# Altium schematic sheet HBridge_Top_Level.SchDoc
size A; SheetNumber: 2; SheetTotal: 2
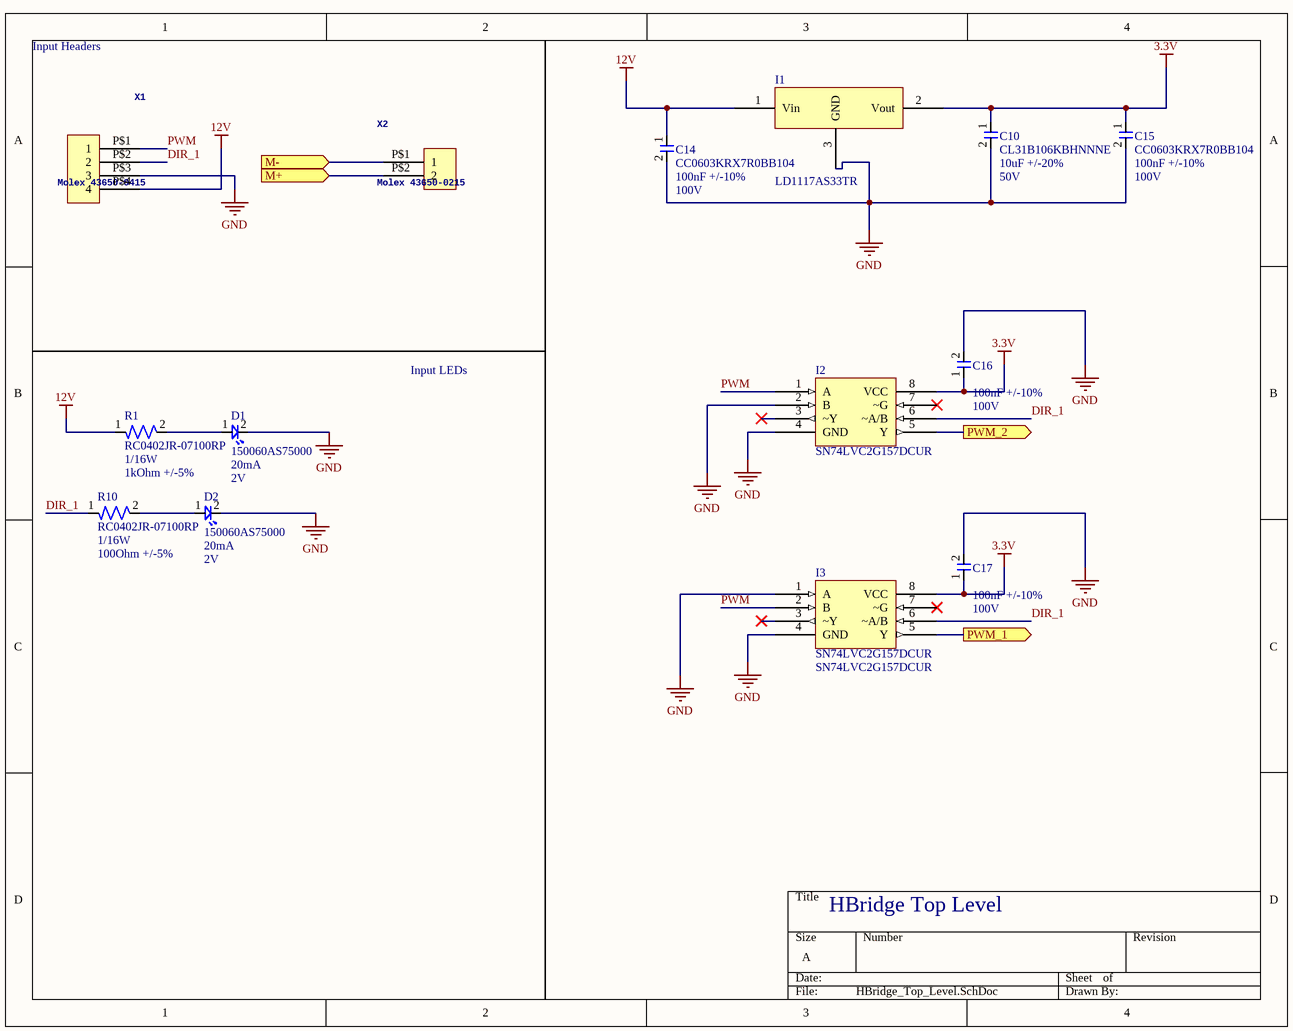
[diagram p0: HBridge_Top_Level.SchDoc]

## Parts
C10  CL31B106KBHNNNE  Capacitance: 10uF +/-20%  Voltage Rating: 50V  [CAP-1206]
C14  CC0603KRX7R0BB104  Capacitance: 100nF +/-10%  Voltage Rating: 100V  [CAP-0603]
C15  CC0603KRX7R0BB104  Capacitance: 100nF +/-10%  Voltage Rating: 100V  [CAP-0603]
C16  Capacitance: 100nF +/-10%  Voltage Rating: 100V  [CAP-0603]  (hidden comment: CC0603KRX7R0BB104)
C17  Capacitance: 100nF +/-10%  Voltage Rating: 100V  [CAP-0603]  (hidden comment: CC0603KRX7R0BB104)
D1  150060AS75000  Current Rating: 20mA  Vf: 2V  [LED-0603]
D2  150060AS75000  Current Rating: 20mA  Vf: 2V  [LED-0603]
I1  LD1117AS33TR  [IC-SOT-223]
I2  SN74LVC2G157DCUR  [IC-MUX-8VSSOP]
I3  SN74LVC2G157DCUR  [IC-MUX-8VSSOP]
R1  RC0402JR-07100RP  Power Rating: 1/16W  Resistance: 1kOhm +/-5%  [RES-0402]
R10  RC0402JR-07100RP  Power Rating: 1/16W  Resistance: 100Ohm +/-5%  [RES-0402]
X1  Molex 43650-0415  [43650-0415]
X2  Molex 43650-0215  [43650-0215]

## Ports
M+ (in, see HBridge_Design[2B]), M- (in, see HBridge_Design[2B]), PWM_1 (out, see HBridge_Design[1D]), PWM_2 (out, see HBridge_Design[1D])

## Nets
3.3V: C10.1 C15.1 C16.1 C17.1 I1.2(Vout) I2.8(VCC) I3.8(VCC)
12V: C14.1 I1.1(Vin) R1.1 X1.P$4(4)
GND: C10.2 C14.2 C15.2 C16.2 C17.2 D1.2 D2.2 I1.3(GND) I2.2(B) I2.4(GND) I3.1(A) I3.4(GND) X1.P$3(3)
DIR_1: I2.6(~A/B) I3.6(~A/B) R10.1 X1.P$2(2)
M+: X2.P$2(2) ; port M+
M-: X2.P$1(1) ; port M-
PWM: I2.1(A) I3.2(B) X1.P$1(1)
PWM_1: I3.5(Y) ; port PWM_1
PWM_2: I2.5(Y) ; port PWM_2
NetD1_1: D1.1 R1.2
NetD2_1: D2.1 R10.2

Not connected (* = marked no-connect by the designer): I2 3(~Y)* 7(~G)*; I3 3(~Y)* 7(~G)*

## Notes on the sheet
- Input Headers
- Input LEDs
- HBridge Top Level

## Library data of the parts
C10 = CAP-10U-0001: 10 µF ±10% 50V Ceramic Capacitor X7R 1206 (3216 Metric); Manufacturer: Samsung Electro-Mechanics; Assembled?: no; Manufacturer Part Number: CL31B106KBHNNNE; Temperature Coefficient: X7R; Package Size: 1206
C14-C17 = CAP-100N-0001: CAP CER 0.1UF 100V X7R 0603; Manufacturer: YAGEO; Assembled?: no; Manufacturer Part Number: CC0603KRX7R0BB104; Temperature Coefficient: X7R; Package Size: 0603
D1 D2 = LED_Amber_0001: CAP CER 0.1UF 100V X7R 0603; Manufacturer: Wurth Electronik; Assembled?: no; Color: Amber; Manufacturer Part Number: 150060AS75000; Package Size: 0603
I1 = IC-LDO-0001: Linear Voltage Regulator IC Positive Fixed 1 Output 1A SOT-223; Vout: 3.3V; VIn Max: 15V; Manufacturer Part Number: LD1117AS33TR
I2 = IC-MUX-0001
I3 = IC-MUX-0001: Multiplexer 1 x 2:1 8-VSSOP; Vin: 1.65-5.5V; Manufacturer Part Number: SN74LVC2G157DCUR
R1 = RES-1K-0001: RES SMD 1K OHM 5% 1/16W 0402; Manufacturer Part Number: RC0402JR-071KP; Manufacturer: YAGEO; Assembled?: no; Package Size: 0402
R10 = RES-100-0001: RES SMD 100 OHM 5% 1/16W 0402; Manufacturer: YAGEO; Assembled?: no; Manufacturer Part Number: RC0402JR-07100RP; Package Size: 0402
X1 = Micro-Fit Molex 4 Pin Vertical: GateName_1: G$1; SymbolName_1: HEADER_POS4; DeviceSetName: HEADER_POS4_?; DeviceName: 43650-0415; LibraryName: con-molex-micro-fit-3_0_2; Package: 43650-0415
X2 = Micro-Fit Molex 2 Pin Vertical: GateName_1: G$1; SymbolName_1: HEADER_POS2; DeviceSetName: HEADER_POS2_?; DeviceName: 43650-0215; LibraryName: con-molex-micro-fit-3_0_2; Package: 43650-0215